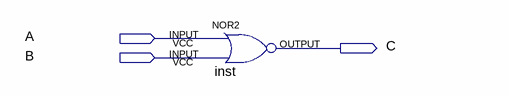
[diagram p0: schematic sheet]
// Quartus schematic NOR_VHDL.bdf as structural Verilog: 1 symbols, 3 pins
module NOR_VHDL (
  input  A,
  input  B,
  output C
);

  // NOR2 inst has open pins: IN1=open, IN2=B, OUT=open
endmodule
